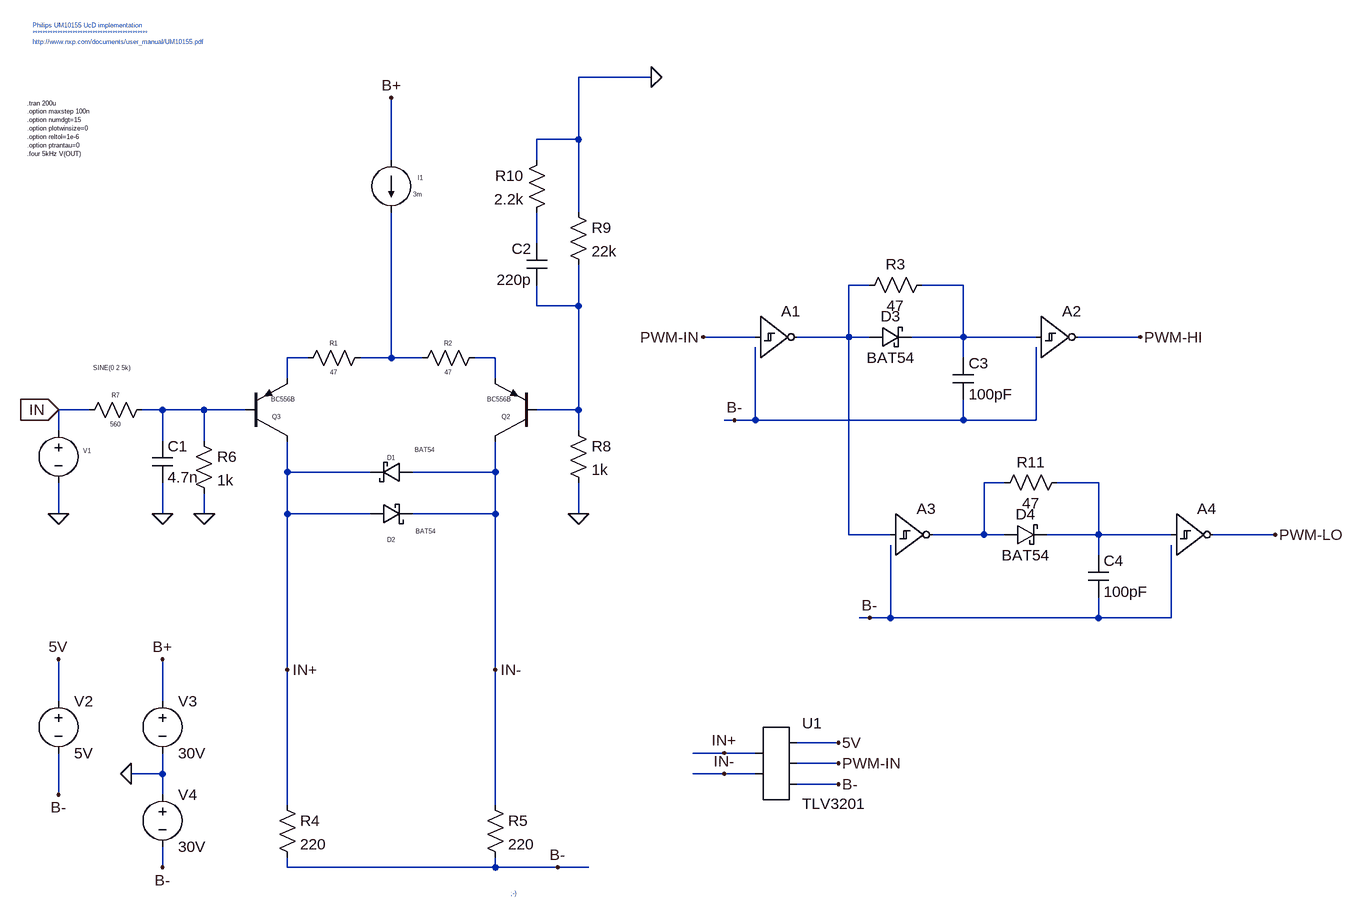
[diagram p0: schematic UcD-LMG5200.asc]
UcD-LMG5200.asc, the LTspice schematic file:
Version 4
SHEET 1 2332 680
WIRE 160 -896 48 -896
WIRE 48 -800 48 -896
WIRE 48 -800 -16 -800
WIRE -240 -768 -240 -864
WIRE -16 -768 -16 -800
WIRE 48 -688 48 -800
WIRE -16 -640 -16 -688
WIRE 496 -576 464 -576
WIRE 640 -576 576 -576
WIRE -16 -544 -16 -576
WIRE 48 -544 48 -608
WIRE 48 -544 -16 -544
WIRE 320 -496 240 -496
WIRE 464 -496 464 -576
WIRE 464 -496 384 -496
WIRE 496 -496 464 -496
WIRE 640 -496 640 -576
WIRE 640 -496 560 -496
WIRE 752 -496 640 -496
WIRE 912 -496 816 -496
WIRE -368 -464 -400 -464
WIRE -240 -464 -240 -688
WIRE -240 -464 -288 -464
WIRE -192 -464 -240 -464
WIRE -80 -464 -112 -464
WIRE 640 -464 640 -496
WIRE -400 -432 -400 -464
WIRE -80 -432 -80 -464
WIRE -704 -384 -752 -384
WIRE -592 -384 -624 -384
WIRE -528 -384 -592 -384
WIRE -464 -384 -528 -384
WIRE 48 -384 48 -544
WIRE 48 -384 -16 -384
WIRE 288 -368 272 -368
WIRE 320 -368 320 -480
WIRE 320 -368 288 -368
WIRE 640 -368 640 -400
WIRE 640 -368 320 -368
WIRE 752 -368 752 -480
WIRE 752 -368 640 -368
WIRE -752 -352 -752 -384
WIRE 48 -352 48 -384
WIRE -592 -336 -592 -384
WIRE -528 -336 -528 -384
WIRE -400 -288 -400 -336
WIRE -272 -288 -400 -288
WIRE -80 -288 -80 -336
WIRE -80 -288 -208 -288
WIRE 704 -272 672 -272
WIRE 848 -272 784 -272
WIRE -752 -224 -752 -272
WIRE -592 -224 -592 -272
WIRE -528 -224 -528 -256
WIRE -400 -224 -400 -288
WIRE -272 -224 -400 -224
WIRE -80 -224 -80 -288
WIRE -80 -224 -208 -224
WIRE 48 -224 48 -272
WIRE 464 -192 464 -496
WIRE 528 -192 464 -192
WIRE 672 -192 672 -272
WIRE 672 -192 592 -192
WIRE 704 -192 672 -192
WIRE 848 -192 848 -272
WIRE 848 -192 768 -192
WIRE 960 -192 848 -192
WIRE 1120 -192 1024 -192
WIRE 848 -160 848 -192
WIRE 496 -64 480 -64
WIRE 528 -64 528 -176
WIRE 528 -64 496 -64
WIRE 848 -64 848 -96
WIRE 848 -64 528 -64
WIRE 960 -64 960 -176
WIRE 960 -64 848 -64
WIRE -400 16 -400 -224
WIRE -80 16 -80 -224
WIRE -752 64 -752 0
WIRE -592 64 -592 0
WIRE 448 128 384 128
WIRE 272 144 224 144
WIRE 320 144 272 144
WIRE 448 160 384 160
WIRE -592 176 -592 144
WIRE -592 176 -640 176
WIRE 272 176 224 176
WIRE 320 176 272 176
WIRE 448 192 384 192
WIRE -752 208 -752 144
WIRE -592 208 -592 176
WIRE -400 224 -400 16
WIRE -80 224 -80 16
WIRE -592 320 -592 288
WIRE -400 320 -400 304
WIRE -80 320 -80 304
WIRE -80 320 -400 320
WIRE 16 320 -80 320
WIRE 64 320 16 320
FLAG -752 -224 0
FLAG -592 -224 0
FLAG -528 -224 0
FLAG 48 -224 0
FLAG -752 -384 IN
IOPIN -752 -384 In
FLAG -752 0 5V
FLAG -400 16 IN+
FLAG -80 16 IN-
FLAG 16 320 B-
FLAG -752 208 B-
FLAG -240 -864 B+
FLAG -640 176 0
FLAG -592 320 B-
FLAG -592 0 B+
FLAG 160 -896 0
FLAG 448 128 5V
FLAG 448 160 PWM-IN
FLAG 448 192 B-
FLAG 272 144 IN+
FLAG 272 176 IN-
FLAG 288 -368 B-
FLAG 912 -496 PWM-HI
FLAG 496 -64 B-
FLAG 1120 -192 PWM-LO
FLAG 240 -496 PWM-IN
SYMBOL voltage -752 -368 R0
WINDOW 3 111 -81 Right 0
WINDOW 123 0 0 Left 0
WINDOW 39 0 0 Left 0
WINDOW 0 38 47 Left 0
SYMATTR Value SINE(0 2 5k)
SYMATTR InstName V1
SYMBOL pnp -16 -336 R180
WINDOW 0 41 37 Left 0
WINDOW 3 39 64 Left 0
SYMATTR InstName Q2
SYMATTR Value BC556B
SYMBOL pnp -464 -336 M180
WINDOW 0 41 37 Left 0
WINDOW 3 39 64 Left 0
SYMATTR InstName Q3
SYMATTR Value BC556B
SYMBOL res -272 -480 R90
WINDOW 0 0 56 VBottom 0
WINDOW 3 32 56 VTop 0
SYMATTR InstName R1
SYMATTR Value 47
SYMBOL res -96 -480 R90
WINDOW 0 0 56 VBottom 0
WINDOW 3 32 56 VTop 0
SYMATTR InstName R2
SYMATTR Value 47
SYMBOL res -416 208 R0
SYMATTR InstName R4
SYMATTR Value 220
SYMBOL res -96 208 R0
SYMATTR InstName R5
SYMATTR Value 220
SYMBOL schottky -208 -304 R90
WINDOW 0 0 32 VBottom 0
WINDOW 3 -25 -19 VTop 0
SYMATTR InstName D1
SYMATTR Value BAT54
SYMBOL schottky -272 -240 M90
WINDOW 0 62 32 VBottom 0
WINDOW 3 36 85 VTop 0
SYMATTR InstName D2
SYMATTR Value BAT54
SYMBOL current -240 -768 R0
WINDOW 0 41 27 Left 0
WINDOW 3 34 52 Left 0
WINDOW 123 0 0 Left 0
WINDOW 39 0 0 Left 0
SYMATTR InstName I1
SYMATTR Value 3m
SYMBOL res -544 -352 R0
SYMATTR InstName R6
SYMATTR Value 1k
SYMBOL cap -608 -336 R0
SYMATTR InstName C1
SYMATTR Value 4.7n
SYMBOL res -608 -400 R90
WINDOW 0 0 56 VBottom 0
WINDOW 3 32 56 VTop 0
SYMATTR InstName R7
SYMATTR Value 560
SYMBOL res 32 -368 R0
SYMATTR InstName R8
SYMATTR Value 1k
SYMBOL res 32 -704 R0
SYMATTR InstName R9
SYMATTR Value 22k
SYMBOL res 0 -784 M0
SYMATTR InstName R10
SYMATTR Value 2.2k
SYMBOL cap 0 -640 M0
SYMATTR InstName C2
SYMATTR Value 220p
SYMBOL voltage -752 48 R0
WINDOW 123 0 0 Left 0
WINDOW 39 0 0 Left 0
SYMATTR InstName V2
SYMATTR Value 5V
SYMBOL voltage -592 48 R0
WINDOW 123 0 0 Left 0
WINDOW 39 0 0 Left 0
SYMATTR InstName V3
SYMATTR Value 30V
SYMBOL voltage -592 192 R0
WINDOW 123 0 0 Left 0
WINDOW 39 0 0 Left 0
SYMATTR InstName V4
SYMATTR Value 30V
SYMBOL AutoGenerated\\TLV3201 352 160 R0
SYMATTR InstName U1
SYMBOL Digital\\schmtinv 320 -560 R0
WINDOW 3 -107 129 Invisible 2
SYMATTR Value Vhigh=5 Vlow=0 Ref=2.5
SYMATTR InstName A1
SYMBOL Digital\\schmtinv 752 -560 R0
WINDOW 3 -107 129 Invisible 2
SYMATTR Value Vhigh=5 Vlow=0 Ref=2.5
SYMATTR InstName A2
SYMBOL schottky 496 -480 R270
WINDOW 0 32 32 VTop 2
WINDOW 3 0 32 VBottom 2
SYMATTR InstName D3
SYMATTR Value BAT54
SYMATTR Description Diode
SYMATTR Type diode
SYMBOL res 592 -592 R90
WINDOW 0 0 56 VBottom 2
WINDOW 3 32 56 VTop 2
SYMATTR InstName R3
SYMATTR Value 47
SYMBOL cap 624 -464 R0
SYMATTR InstName C3
SYMATTR Value 100pF
SYMBOL Digital\\schmtinv 528 -256 R0
WINDOW 3 -107 129 Invisible 2
SYMATTR Value Vhigh=5 Vlow=0 Ref=2.5
SYMATTR InstName A3
SYMBOL schottky 704 -176 R270
WINDOW 0 32 32 VTop 2
WINDOW 3 0 32 VBottom 2
SYMATTR InstName D4
SYMATTR Value BAT54
SYMATTR Description Diode
SYMATTR Type diode
SYMBOL res 800 -288 R90
WINDOW 0 0 56 VBottom 2
WINDOW 3 32 56 VTop 2
SYMATTR InstName R11
SYMATTR Value 47
SYMBOL cap 832 -160 R0
SYMATTR InstName C4
SYMATTR Value 100pF
SYMBOL Digital\\schmtinv 960 -256 R0
WINDOW 3 -107 129 Invisible 2
SYMATTR Value Vhigh=5 Vlow=0 Ref=2.5
SYMATTR InstName A4
TEXT -56 360 Left 0 ;;-)
TEXT -792 -976 Left 0 ;Philips UM10155 UcD implementation\n**********************************************\nhttp://www.nxp.com/documents/user_manual/UM10155.pdf
TEXT -800 -856 Left 0 !.tran 200u\n.option maxstep 100n\n.option numdgt=15\n.option plotwinsize=0\n.option reltol=1e-6\n.option ptrantau=0\n.four 5kHz V(OUT)

The netlist it stands for:
* UcD-LMG5200.asc
V1 IN 0 SINE(0 2 5k)
Q2 IN- N004 N007 0 BC556B
Q3 IN+ N008 N005 0 BC556B
R1 N006 N005 47
R2 N007 N006 47
R4 IN+ B- 220
R5 IN- B- 220
D1 IN- IN+ BAT54
D2 IN+ IN- BAT54
I1 B+ N006 3m
R6 N008 0 1k
C1 N008 0 4.7n
R7 N008 IN 560
R8 N004 0 1k
R9 0 N004 22k
R10 0 N001 2.2k
C2 N001 N004 220p
V2 5V B- 5V
V3 B+ 0 30V
V4 0 B- 30V
* U1: TLV3201 (symbol AutoGenerated\TLV3201 not available, pins judged from their places): pin1=IN+ pin2=IN- pin3=5V pin4=PWM-IN pin5=B-
A1 PWM-IN B- B- B- B- N002 B- B- SCHMITT Vhigh=5 Vlow=0 Ref=2.5
A2 N003 B- B- B- B- PWM-HI B- B- SCHMITT Vhigh=5 Vlow=0 Ref=2.5
D3 N002 N003 BAT54
R3 N003 N002 47
C3 N003 B- 100pF
A3 N002 B- B- B- B- N009 B- B- SCHMITT Vhigh=5 Vlow=0 Ref=2.5
D4 N009 N010 BAT54
R11 N010 N009 47
C4 N010 B- 100pF
A4 N010 B- B- B- B- PWM-LO B- B- SCHMITT Vhigh=5 Vlow=0 Ref=2.5
.model D D
.lib standard.dio
.model NPN NPN
.model PNP PNP
.lib standard.bjt
* ;-)
* Philips UM10155 UcD implementation
* **********************************************
* http://www.nxp.com/documents/user_manual/UM10155.pdf
.tran 200u
.option maxstep 100n
.option numdgt=15
.option plotwinsize=0
.option reltol=1e-6
.option ptrantau=0
.four 5kHz V(OUT)
.backanno
.end